# Altium project imu_sense.PrjPcb
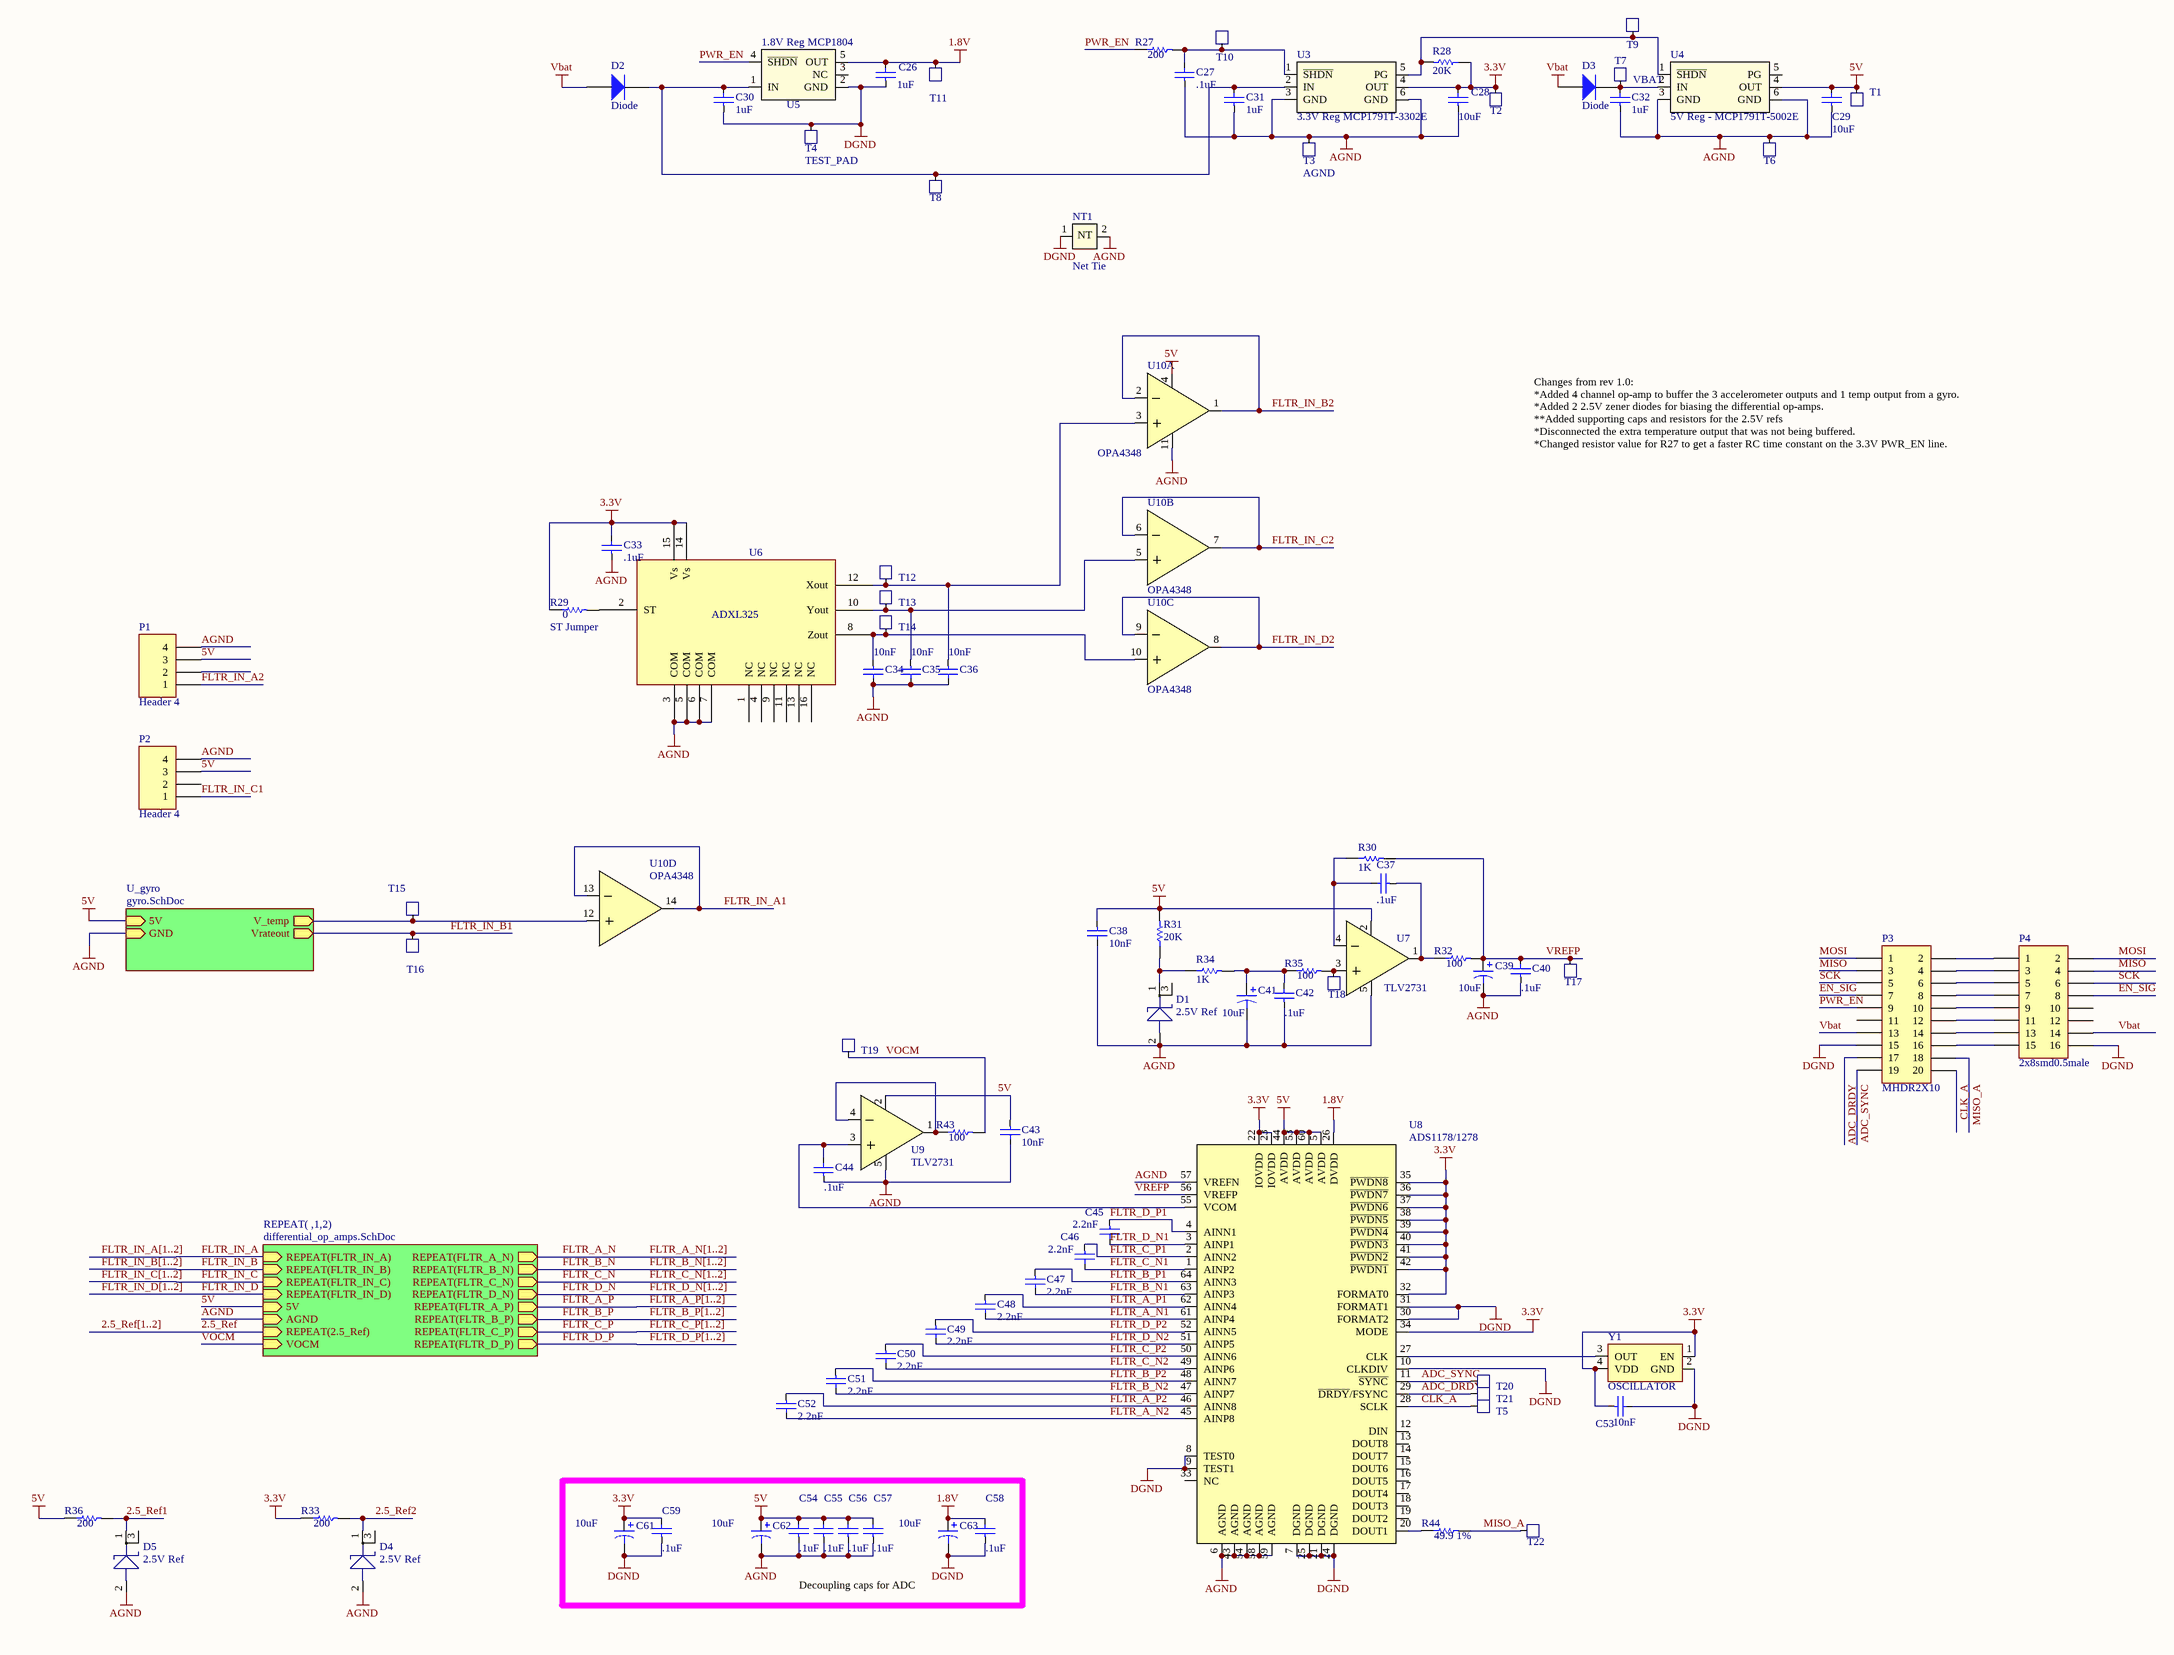
[diagram p0: imu_sense.SchDoc]
3 sheets, 188 parts. Net scope: hierarchical (ports join the sheet entries above them; power ports are global).
Board file: imu_sense.PcbDoc
Sheets:
  imu_sense.SchDoc
    1 = differential_op_amps.SchDoc
    2 = differential_op_amps.SchDoc
    U_gyro = gyro.SchDoc

## Sheet imu_sense.SchDoc
size C

### Parts
C26  1uF  [0603 (1608)]
C27  value .1uF  [0603 (1608)]  (hidden comment: Capacitor)
C28  10uF  [0603 (1608)]
C29  10uF  [0603 (1608)]
C30  1uF  [0603 (1608)]
C31  value 1uF  [0603 (1608)]  (hidden comment: Capacitor)
C32  value 1uF  [0603 (1608)]  (hidden comment: Capacitor)
C33  value .1uF  [0603 (1608)]  (hidden comment: Capacitor)
C34  10nF  [0603 (1608)]
C35  10nF  [0603 (1608)]
C36  10nF  [0603 (1608)]
C37  value .1uF  [0603 (1608)]  (hidden comment: Capacitor)
C38  10nF  [0603 (1608)]
C39  value 10uF  [CAP-POL 0603(1608)]  (hidden comment: tant)
C40  value .1uF  [0603 (1608)]  (hidden comment: Capacitor)
C41  value 10uF  [CAP-POL 0603(1608)]  (hidden comment: tant)
C42  value .1uF  [0603 (1608)]  (hidden comment: Capacitor)
C43  10nF  [0603 (1608)]
C44  value .1uF  [0603 (1608)]  (hidden comment: Capacitor)
C45  value 2.2nF  [0603 (1608)]  (hidden comment: Capacitor)
C46  value 2.2nF  [0603 (1608)]  (hidden comment: Capacitor)
C47  value 2.2nF  [0603 (1608)]  (hidden comment: Capacitor)
C48  value 2.2nF  [0603 (1608)]  (hidden comment: Capacitor)
C49  value 2.2nF  [0603 (1608)]  (hidden comment: Capacitor)
C50  value 2.2nF  [0603 (1608)]  (hidden comment: Capacitor)
C51  value 2.2nF  [0603 (1608)]  (hidden comment: Capacitor)
C52  value 2.2nF  [0603 (1608)]  (hidden comment: Capacitor)
C53  10nF  [0603 (1608)]
C54  value .1uF  [0603 (1608)]  (hidden comment: Capacitor)
C55  value .1uF  [0603 (1608)]  (hidden comment: Capacitor)
C56  value .1uF  [0603 (1608)]  (hidden comment: Capacitor)
C57  value .1uF  [0603 (1608)]  (hidden comment: Capacitor)
C58  value .1uF  [0603 (1608)]  (hidden comment: Capacitor)
C59  value .1uF  [0603 (1608)]  (hidden comment: Capacitor)
C61  value 10uF  [CAP-POL 0603(1608)]  (hidden comment: tant)
C62  value 10uF  [CAP-POL 0603(1608)]  (hidden comment: tant)
C63  value 10uF  [CAP-POL 0603(1608)]  (hidden comment: tant)
D1  2.5V Ref  [SC-70]
D2  Diode  [0603(1608) diode - line on pin2]
D3  Diode  [0603(1608) diode - line on pin2]
D4  2.5V Ref  [SC-70]
D5  2.5V Ref  [SC-70]
NT1  Net Tie  [NET_TIE]  (net tie, no BOM)
P1  Header 4  [gyro mount]
P2  Header 4  [gyro mount]
P3  MHDR2X10  [S9013E-10-ND]
P4  2x8smd0.5male  [Header, right hole]
R27  200  [0603 (1608)]
R28  20K  [0603 (1608)]
R29  ST Jumper  value 0  [0603 (1608)]
R30  1K  [0603 (1608)]
R31  20K  [0603 (1608)]
R32  100  [0603 (1608)]
R33  200  [0603 (1608)]
R34  1K  [0603 (1608)]
R35  100  [0603 (1608)]
R36  200  [0603 (1608)]
R43  100  [0603 (1608)]
R44  value 49.9 1%  [0603 (1608)]  (hidden comment: 931 1%)
T1  TEST_PAD  [TEST_PAD]  (value not drawn)
T2  TEST_PAD  [TEST_PAD]  (value not drawn)
T3  AGND  [TEST_PAD]
T4  TEST_PAD  [TEST_PAD]
T5  TEST_PAD  [TEST_PAD]  (value not drawn)
T6  TEST_PAD  [TEST_PAD]  (value not drawn)
T7  VBAT  [TEST_PAD]
T8  TEST_PAD  [TEST_PAD]  (value not drawn)
T9  TEST_PAD  [TEST_PAD]  (value not drawn)
T10  TEST_PAD  [TEST_PAD]  (value not drawn)
T11  TEST_PAD  [TEST_PAD]  (value not drawn)
T12  (no value)  [TEST_PAD]
T13  (no value)  [TEST_PAD]
T14  (no value)  [TEST_PAD]
T15  (no value)  [TEST_PAD]
T16  (no value)  [TEST_PAD]
T17  (no value)  [TEST_PAD]
T18  (no value)  [TEST_PAD]
T19  (no value)  [TEST_PAD]
T20  (no value)  [TEST_PAD]
T21  (no value)  [TEST_PAD]
T22  TEST_PAD  [TEST_PAD]  (value not drawn)
U3  3.3V Reg MCP1791T-3302E  [SOT223 - 5 leads + tab]
U4  5V Reg - MCP1791T-5002E  [SOT223 - 5 leads + tab]
U5  1.8V Reg MCP1804  [SOT23-5 - MCP1804T]
U6  ADXL325  [LFCSP_LQ_AXDL]
U7  TLV2731  [SOT23-5 Ti Op Amp]
U8  ADS1178/1278  [S-PQFP-G64]
U9  TLV2731  [SOT23-5 Ti Op Amp]
U10  OPA4348  [TSSOP-14]  (parts A,B,C,D of 4)
Y1  OSCILLATOR  [ABRACON Oscillator]

### Blocks framed on the sheet
Decoupling caps for ADC: C54-C59 C61-C63

### Sub-sheets
REPEAT( ,1,2) = differential_op_amps.SchDoc: REPEAT(FLTR_A_N) (out), REPEAT(FLTR_B_N) (out), REPEAT(FLTR_C_N) (out), REPEAT(FLTR_D_N) (out), REPEAT(FLTR_A_P) (out), REPEAT(FLTR_B_P) (out), REPEAT(FLTR_C_P) (out), REPEAT(FLTR_D_P) (out), REPEAT(FLTR_IN_A) (in), REPEAT(FLTR_IN_B) (in), REPEAT(FLTR_IN_C) (in), REPEAT(FLTR_IN_D) (in), 5V (in), AGND (in), VOCM (in), REPEAT(2.5_Ref) (in)
U_gyro = gyro.SchDoc: V_temp (out), Vrateout (out), 5V (in), GND (in)

### Nets
1.8V: C26.1 C58.1 C63.1 T11.0 U5.5(OUT) U8.26(DVDD)
3.3V: C28.1 C33.1 C53.2 C59.1 C61.1 R28.1 R29.1 R33.1 T2.0 U3.4(OUT) U6.14(Vs) U6.15(Vs) U8.22(IOVDD) U8.23(IOVDD) U8.32(FORMAT0) U8.34(MODE) U8.35(~{PWDN8}) U8.36(~{PWDN7}) U8.37(~{PWDN6}) U8.38(~{PWDN5}) U8.39(~{PWDN4}) U8.40(~{PWDN3}) U8.41(~{PWDN2}) U8.42(~{PWDN1}) Y1.1(EN) Y1.4(VDD)
5V: C29.1 C38.2 C43.2 C54.1 C55.1 C56.1 C57.1 C62.1 P1.3 P2.3 R31.2 R36.1 T1.0 U4.4(OUT) U7.2(V+) U8.5(AVDD) U8.44(AVDD) U8.53(AVDD) U8.60(AVDD) U9.2(V+) U10.4(V+) ; sheet REPEAT( ,1,2)/5V, sheet U_gyro/5V
AGND: C27.2 C28.2 C29.2 C31.2 C32.2 C33.2 C34.1 C35.1 C36.1 C38.1 C39.2 C40.2 C41.2 C42.2 C43.1 C44.2 C54.2 C55.2 C56.2 C57.2 C62.2 D1.2(Anode) D4.2(Anode) D5.2(Anode) NT1.2 P1.4 P2.4 T3.0 T6.0 U3.3(GND) U3.6(GND) U4.3(GND) U4.6(GND) U6.3(COM) U6.5(COM) U6.6(COM) U6.7(COM) U7.5(V-) U8.6(AGND) U8.43(AGND) U8.54(AGND) U8.57(VREFN) U8.58(AGND) U8.59(AGND) U9.5(V-) U10.11(V-) ; sheet REPEAT( ,1,2)/AGND, sheet U_gyro/GND
DGND: C26.2 C30.2 C53.1 C58.2 C59.2 C61.2 C63.2 NT1.1 P3.15 P4.16 T4.0 U5.2(GND) U8.7(DGND) U8.8(TEST0) U8.9(TEST1) U8.10(CLKDIV) U8.21(DGND) U8.24(DGND) U8.25(DGND) U8.30(FORMAT2) U8.31(FORMAT1) Y1.2(GND)
Vbat: D2.1(A) D3.1(A) P3.13 P4.14
2.5_Ref: sheet REPEAT( ,1,2)/REPEAT(2.5_Ref)
2.5_Ref1: D5.1(Cathode) R36.2
2.5_Ref2: D4.1(Cathode) R33.2
ADC_DRDY: P3.17 T21.0 U8.29(~{DRDY}/FSYNC)
ADC_SYNC: P3.19 T20.0 U8.11(~{SYNC})
CLK_A: P3.20 T5.0 U8.28(SCLK)
EN_SIG: P3.7 P4.8
FLTR_A_N: sheet REPEAT( ,1,2)/REPEAT(FLTR_A_N)
FLTR_A_N1: C48.1 U8.61(AINP4)  [project net FLTR_A_N]
FLTR_A_N2: C52.1 U8.45(AINP8)  [project net FLTR_A_N]
FLTR_A_P: sheet REPEAT( ,1,2)/REPEAT(FLTR_A_P)
FLTR_A_P1: C48.2 U8.62(AINN4)  [project net FLTR_A_P]
FLTR_A_P2: C52.2 U8.46(AINN8)  [project net FLTR_A_P]
FLTR_B_N: sheet REPEAT( ,1,2)/REPEAT(FLTR_B_N)
FLTR_B_N1: C47.1 U8.63(AINP3)  [project net FLTR_B_N]
FLTR_B_N2: C51.1 U8.47(AINP7)  [project net FLTR_B_N]
FLTR_B_P: sheet REPEAT( ,1,2)/REPEAT(FLTR_B_P)
FLTR_B_P1: C47.2 U8.64(AINN3)  [project net FLTR_B_P]
FLTR_B_P2: C51.2 U8.48(AINN7)  [project net FLTR_B_P]
FLTR_C_N: sheet REPEAT( ,1,2)/REPEAT(FLTR_C_N)
FLTR_C_N1: C46.1 U8.1(AINP2)  [project net FLTR_C_N]
FLTR_C_N2: C50.1 U8.49(AINP6)  [project net FLTR_C_N]
FLTR_C_P: sheet REPEAT( ,1,2)/REPEAT(FLTR_C_P)
FLTR_C_P1: C46.2 U8.2(AINN2)  [project net FLTR_C_P]
FLTR_C_P2: C50.2 U8.50(AINN6)  [project net FLTR_C_P]
FLTR_D_N: sheet REPEAT( ,1,2)/REPEAT(FLTR_D_N)
FLTR_D_N1: C45.1 U8.3(AINP1)  [project net FLTR_D_N]
FLTR_D_N2: C49.1 U8.51(AINP5)  [project net FLTR_D_N]
FLTR_D_P: sheet REPEAT( ,1,2)/REPEAT(FLTR_D_P)
FLTR_D_P1: C45.2 U8.4(AINN1)  [project net FLTR_D_P]
FLTR_D_P2: C49.2 U8.52(AINN5)  [project net FLTR_D_P]
FLTR_IN_A: sheet REPEAT( ,1,2)/REPEAT(FLTR_IN_A)
FLTR_IN_A1: U10.13(-IN) U10.14(Out)  [project net FLTR_IN_A]
FLTR_IN_A2: P1.1  [project net FLTR_IN_A]
FLTR_IN_B: sheet REPEAT( ,1,2)/REPEAT(FLTR_IN_B)
FLTR_IN_B1: T16.0 ; sheet U_gyro/Vrateout  [project net FLTR_IN_B]
FLTR_IN_B2: U10.1(Out) U10.2(-IN)  [project net FLTR_IN_B]
FLTR_IN_C: sheet REPEAT( ,1,2)/REPEAT(FLTR_IN_C)
FLTR_IN_C1: P2.1  [project net FLTR_IN_C]
FLTR_IN_C2: U10.6(-IN) U10.7(Out)  [project net FLTR_IN_C]
FLTR_IN_D: sheet REPEAT( ,1,2)/REPEAT(FLTR_IN_D)
FLTR_IN_D2: U10.8(Out) U10.9(-IN)  [project net FLTR_IN_D]
MISO: P3.3 P4.4
MISO_A: P3.18 R44.2 T22.0
MOSI: P3.1 P4.2
PWR_EN: P3.9 R27.1 U5.4(~{SHDN})
SCK: P3.5 P4.6
V_temp: T15.0 U10.12(+IN) ; sheet U_gyro/V_temp
VOCM: R43.2 T19.0 ; sheet REPEAT( ,1,2)/VOCM
VREFP: C39.1 C40.1 R30.2 R32.2 T17.0 U8.56(VREFP)
NetC27_1: C27.1 R27.2 T10.0 U3.1(~{SHDN})
NetC30_1: C30.1 C31.1 D2.2(K) T8.0 U3.2(IN) U5.1(IN)
NetC32_1: C32.1 D3.2(K) T7.0 U4.2(IN)
NetC34_2: C34.2 T14.0 U6.8(Zout) U10.10(+IN)
NetC35_2: C35.2 T13.0 U6.10(Yout) U10.5(+IN)
NetC36_2: C36.2 T12.0 U6.12(Xout) U10.3(+IN)
NetC37_1: C37.1 R30.1 U7.4(-IN)
NetC37_2: C37.2 R32.1 U7.1(Out)
NetC41_1: C41.1 C42.1 R34.2 R35.1
NetC44_1: C44.1 U8.55(VCOM) U9.3(+IN)
NetD1_1: D1.1(Cathode) R31.1 R34.1
NetP3_2: P3.2 P4.1
NetP3_4: P3.4 P4.3
NetP3_6: P3.6 P4.5
NetP3_8: P3.8 P4.7
NetP3_10: P3.10 P4.9
NetP3_12: P3.12 P4.11
NetP3_14: P3.14 P4.13
NetP3_16: P3.16 P4.15
NetR28_2: R28.2 T9.0 U3.5(PG) U4.1(~{SHDN})
NetR29_2: R29.2 U6.2(ST)
NetR35_2: R35.2 T18.0 U7.3(+IN)
NetR43_1: R43.1 U9.1(Out) U9.4(-IN)
NetR44_1: R44.1 U8.20(DOUT1)
NetU8_27: U8.27(CLK) Y1.3(OUT)

Not connected (* = marked no-connect by the designer): D1 3(Trim); D4 3(Trim); D5 3(Trim); P1 2; P2 2; P3 11; P4 10 12; U4 5(PG); U5 3(NC); U6 1(NC) 4(NC) 9(NC) 11(NC) 13(NC) 16(NC); U8 12(DIN) 13(DOUT8) 14(DOUT7) 15(DOUT6) 16(DOUT5) 17(DOUT4) 18(DOUT3) 19(DOUT2) 33(NC)

### Buses and harness runs
bus 2.5_Ref[1..2]
bus FLTR_A_N[1..2]
bus FLTR_A_P[1..2]
bus FLTR_B_N[1..2]
bus FLTR_B_P[1..2]
bus FLTR_C_N[1..2]
bus FLTR_C_P[1..2]
bus FLTR_D_N[1..2]
bus FLTR_D_P[1..2]
bus FLTR_IN_A[1..2]
bus FLTR_IN_B[1..2]
bus FLTR_IN_C[1..2]
bus FLTR_IN_D[1..2]

### Notes on the sheet
- Changes from rev 1.0:
  *Added 4 channel op-amp to buffer the 3 accelerometer outputs and 1 temp output from a gyro.
  *Added 2 2.5V zener diodes for biasing the differential op-amps.
  **Added supporting caps and resistors for the 2.5V refs
  *Disconnected the extra temperature output that was not being buffered.
  *Changed resistor value for R27 to get a faster RC time constant on the 3.3V PWR_EN line.
- (in symbol NET_TIE) NT

### Library data of the parts
C26 C30-C32 = Capacitor: Manufacturer: Murata; Part No.: 81-GRM188R61E105KA12; Vendor: Mouser; Tolerance: 10%; Voltage: 25V; Price Est.: $0.08
  C26 C30: Value: 1uF
C27 C33 C37 C40 C42 C44 C54-C59 = Capacitor: Manufacturer: Murata; Part No.: 490-1524-1-ND; Vendor: Digikey; Price Est.: $0.019
C28 C29 = Capacitor: Manufacturer: Murata; Part No.: 810-C1608X5R0J106K; Vendor: Mouser; Tolerance: 10%; Voltage: 6.3V; Price Est.: $0.56; Value: 10uF
C34-C36 C38 C43 C53 = Capacitor: Manufacturer: TDK; Part No.: 445-5099-1-ND; Vendor: Digikey; Tolerance: 5%; Price Est.: $0.044; Value: 10nF
C39 C41 C61-C63 = Cap Pol3: Polarized Capacitor (Surface Mount); Part No.: 71-298D106X06R3M2T; Special: Tantalum; Estimated Cost: $1.21; Vendor: Mouser
C45-C52 = Capacitor: COG Ceramic Cap -> near input to ads1178; Manufacturer: Murata; Part No.: 490-1459-1-ND; Vendor: Digikey; Special: COG, NPO; Price Est.: $0.078
D1 D4 D5 = ZENER: 2.5 volt ref; Part No.: ADR525BKSZ-REEL7CT-ND; Manufacturer: Analog Devices; Vendor: Digikey; Price Est.: $2.20
D2 D3 = Diode: Reverse voltage protection diode; Part No.: 641-1332-1-ND; Vendor: Digikey; Reverse Voltage: 20V; Forward Current: 500mA; Price Est.: $0.46
NT1 = NET_TIE
P1 P2 = Header 4: Header, 4-Pin; Part No.: A31114-ND; Vendor: Digikey; Price Est.: $0.20
P3 = MHDR2X10: Header, 10-Pin, Female; Part No.: S9007E-10-ND; Vendor: Digikey; Price Est.: $2.28
P4 = 2x8smd0.5male: Part No.: S9013E-08-ND; Vendor: Digikey; Price Est.: 1.43
R27 R33 R36 = Res1: Resistor; Part No.: P200GCT-ND; Vendor: Digikey; Value: 200; Price Est.: $0.03
R28 R31 = Res1: Resistor; Part No.: P20KGCT-ND; Vendor: Digikey; Value: 20K; Price Est.: $0.03
R29 = Res1: Resistor; Part No.: P0.0GCT-ND; Price Est.: $0.03
R30 R34 = Res1: Resistor; Part No.: P1.0KGCT-ND; Vendor: Digikey; Estimated Cost: $0.03; Tolerance: 5%; Value: 1K
R32 R35 R43 = Res1: Resistor; Part No.: P100GCT-ND; Vendor: Digikey; Value: 100; Price Est.: $0.03
R44 = Res1: Resistor; Part No.: P49.9HCT-ND; Vendor: Digikey; Price Est.: $0.04
T3 T7 T12-T21 = TEST_PAD
U3 = 5V Reg - MCP1791T-5002E/DC: 3.3V, 70mA LDO with SHDN and PWRGD pins; Part No.: MCP1791T-3302E/DCCT-ND; Vendor: Digikey; Price Est.: $0.90
U4 = 5V Reg - MCP1791T-5002E/DC: 5V, 70mA LDO with SHDN and PWRGD pins; Part No.: MCP1791T-5002E/DCCT-ND; Vendor: Digikey; Price Est.: $0.90
U5 = 1.8V Reg: 1.8V Reg. MCP1804; Part No.: MCP1804T-1802I/OTCT-ND; Vendor: Digikey; Price Est.: $0.81
U6 = ADXL325: Part No.: ADXL325BCPZ-RL7CT-ND; Vendor: Digikey; Price Est.: $4.82
U7 U9 = TI Small Op Amp: Part No.: 296-10656-1-ND; Manufacturer: Texas Instruments; Vendor: Digikey; Price Est.: $1.41
U8 = ADS1178: The ADS1178 and 1278 are pin compatible. 16 and 24 bits, respectively.; Manufacturer: Texas Instruments; Vendor: Digikey; Price Est.: $21.00
Y1 = OSCILLATOR: Part No.: 535-9778-1-ND; Manufacturer: Abracon; Frequency: 1.8432 MHz; Vendor: Digikey; Price Est.: $2.93

## Sheet differential_op_amps.SchDoc
size A
Used 2 times, as channels 1, 2. Parts and nets are listed once, with the designators drawn on the sheet.
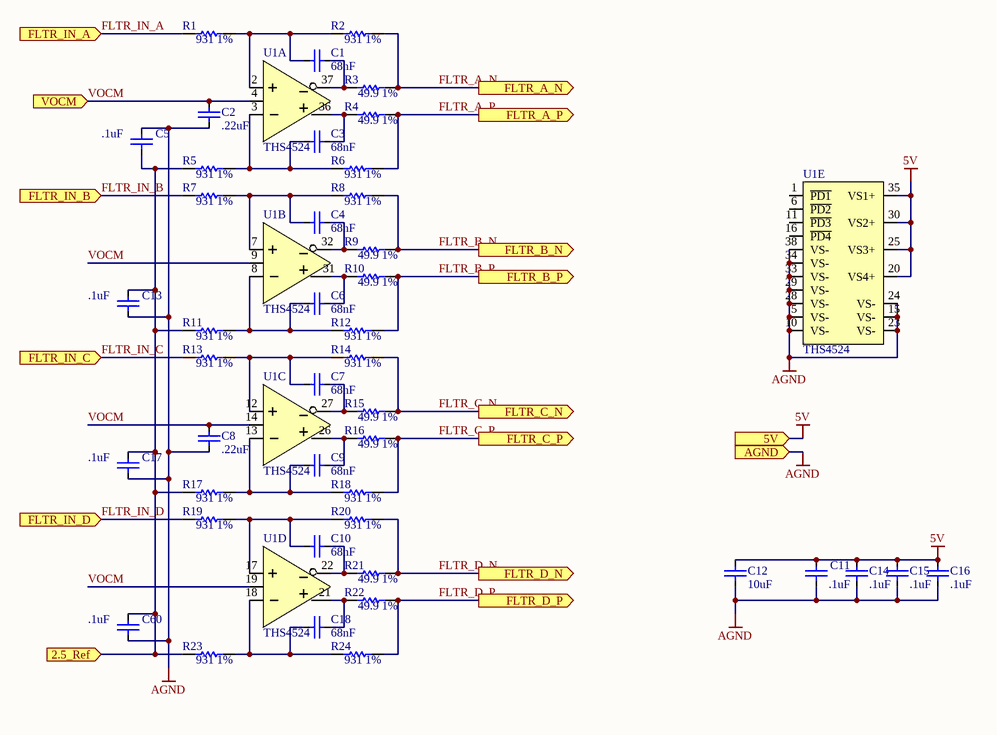
[diagram p1: differential_op_amps.SchDoc]

### Parts
C1  value 68nF  [0603 (1608)]  (hidden comment: Capacitor)
C2  value .22uF  [0603 (1608)]  (hidden comment: Capacitor)
C3  value 68nF  [0603 (1608)]  (hidden comment: Capacitor)
C4  value 68nF  [0603 (1608)]  (hidden comment: Capacitor)
C5  value .1uF  [0603 (1608)]  (hidden comment: Capacitor)
C6  value 68nF  [0603 (1608)]  (hidden comment: Capacitor)
C7  value 68nF  [0603 (1608)]  (hidden comment: Capacitor)
C8  value .22uF  [0603 (1608)]  (hidden comment: Capacitor)
C9  value 68nF  [0603 (1608)]  (hidden comment: Capacitor)
C10  value 68nF  [0603 (1608)]  (hidden comment: Capacitor)
C11  value .1uF  [0603 (1608)]  (hidden comment: Capacitor)
C12  value 10uF  [0603 (1608)]  (hidden comment: Capacitor)
C13  value .1uF  [0603 (1608)]  (hidden comment: Capacitor)
C14  value .1uF  [0603 (1608)]  (hidden comment: Capacitor)
C15  value .1uF  [0603 (1608)]  (hidden comment: Capacitor)
C16  value .1uF  [0603 (1608)]  (hidden comment: Capacitor)
C17  value .1uF  [0603 (1608)]  (hidden comment: Capacitor)
C18  value 68nF  [0603 (1608)]  (hidden comment: Capacitor)
C60  value .1uF  [0603 (1608)]  (hidden comment: Capacitor)
R1  931 1%  [0603 (1608)]
R2  931 1%  [0603 (1608)]
R3  value 49.9 1%  [0603 (1608)]  (hidden comment: 931 1%)
R4  value 49.9 1%  [0603 (1608)]  (hidden comment: 931 1%)
R5  931 1%  [0603 (1608)]
R6  931 1%  [0603 (1608)]
R7  931 1%  [0603 (1608)]
R8  931 1%  [0603 (1608)]
R9  value 49.9 1%  [0603 (1608)]  (hidden comment: 931 1%)
R10  value 49.9 1%  [0603 (1608)]  (hidden comment: 931 1%)
R11  931 1%  [0603 (1608)]
R12  931 1%  [0603 (1608)]
R13  931 1%  [0603 (1608)]
R14  931 1%  [0603 (1608)]
R15  value 49.9 1%  [0603 (1608)]  (hidden comment: 931 1%)
R16  value 49.9 1%  [0603 (1608)]  (hidden comment: 931 1%)
R17  931 1%  [0603 (1608)]
R18  931 1%  [0603 (1608)]
R19  931 1%  [0603 (1608)]
R20  931 1%  [0603 (1608)]
R21  value 49.9 1%  [0603 (1608)]  (hidden comment: 931 1%)
R22  value 49.9 1%  [0603 (1608)]  (hidden comment: 931 1%)
R23  931 1%  [0603 (1608)]
R24  931 1%  [0603 (1608)]
U1  THS4524  [TSSOP-38]  (parts A,B,C,D,E of 5)

### Ports
2.5_Ref (in), 5V (in), AGND (in), FLTR_A_N (out), FLTR_A_P (out), FLTR_B_N (out), FLTR_B_P (out), FLTR_C_N (out), FLTR_C_P (out), FLTR_D_N (out), FLTR_D_P (out), FLTR_IN_A (in), FLTR_IN_B (in), FLTR_IN_C (in), FLTR_IN_D (in), VOCM (in)

### Nets
5V: C11.1 C12.1 C14.1 C15.1 C16.1 U1.20(VS4+) U1.25(VS3+) U1.30(VS2+) U1.35(VS1+) ; port 5V
AGND: C2.1 C5.1 C8.1 C11.2 C12.2 C13.2 C14.2 C15.2 C16.2 C17.2 C60.2 U1.5(VS-) U1.10(VS-) U1.15(VS-) U1.23(VS-) U1.24(VS-) U1.28(VS-) U1.29(VS-) U1.33(VS-) U1.34(VS-) U1.38(VS-) ; port AGND
2.5_Ref: C5.2 C13.1 C17.1 C60.1 R5.1 R11.1 R17.1 R23.1 ; port 2.5_Ref
FLTR_A_N: R2.2 R3.2 ; port FLTR_A_N
FLTR_A_P: R4.2 R6.2 ; port FLTR_A_P
FLTR_B_N: R8.2 R9.2 ; port FLTR_B_N
FLTR_B_P: R10.2 R12.2 ; port FLTR_B_P
FLTR_C_N: R14.2 R15.2 ; port FLTR_C_N
FLTR_C_P: R16.2 R18.2 ; port FLTR_C_P
FLTR_D_N: R20.2 R21.2 ; port FLTR_D_N
FLTR_D_P: R22.2 R24.2 ; port FLTR_D_P
FLTR_IN_A: R1.1 ; port FLTR_IN_A
FLTR_IN_B: R7.1 ; port FLTR_IN_B
FLTR_IN_C: R13.1 ; port FLTR_IN_C
FLTR_IN_D: R19.1 ; port FLTR_IN_D
VOCM: C2.2 C8.2 U1.4(VOCM1) U1.9(VOCM2) U1.14(VOCM3) U1.19(VOCM4) ; port VOCM
NetC1_1: C1.1 R3.1 U1.37(VOUT1-)
NetC1_2: C1.2 R1.2 R2.1 U1.2(VIN1+)
NetC3_1: C3.1 R4.1 U1.36(VOUT1+)
NetC3_2: C3.2 R5.2 R6.1 U1.3(VIN1-)
NetC4_1: C4.1 R9.1 U1.32(VOUT2-)
NetC4_2: C4.2 R7.2 R8.1 U1.7(VIN2+)
NetC6_1: C6.1 R10.1 U1.31(VOUT2+)
NetC6_2: C6.2 R11.2 R12.1 U1.8(VIN2-)
NetC7_1: C7.1 R15.1 U1.27(VOUT3-)
NetC7_2: C7.2 R13.2 R14.1 U1.12(VIN3+)
NetC9_1: C9.1 R16.1 U1.26(VOUT3+)
NetC9_2: C9.2 R17.2 R18.1 U1.13(VIN3-)
NetC10_1: C10.1 R21.1 U1.22(VOUT4_)
NetC10_2: C10.2 R19.2 R20.1 U1.17(VIN4+)
NetC18_1: C18.1 R22.1 U1.21(VOUT4+)
NetC18_2: C18.2 R23.2 R24.1 U1.18(VIN4-)

Not connected (* = marked no-connect by the designer): U1 1(~{PD1}) 6(~{PD2}) 11(~{PD3}) 16(~{PD4})

### Channels
1: designators end in _1; ports 2.5_Ref=2.5_Ref1 5V=5V AGND=AGND FLTR_A_N=FLTR_A_N FLTR_A_P=FLTR_A_P FLTR_B_N=FLTR_B_N FLTR_B_P=FLTR_B_P FLTR_C_N=FLTR_C_N FLTR_C_P=FLTR_C_P FLTR_D_N=FLTR_D_N FLTR_D_P=FLTR_D_P FLTR_IN_A=FLTR_IN_A FLTR_IN_B=FLTR_IN_B FLTR_IN_C=FLTR_IN_C FLTR_IN_D=FLTR_IN_D_1 VOCM=VOCM
2: designators end in _2; ports 2.5_Ref=2.5_Ref2 5V=5V AGND=AGND FLTR_A_N=FLTR_A_N FLTR_A_P=FLTR_A_P FLTR_B_N=FLTR_B_N FLTR_B_P=FLTR_B_P FLTR_C_N=FLTR_C_N FLTR_C_P=FLTR_C_P FLTR_D_N=FLTR_D_N FLTR_D_P=FLTR_D_P FLTR_IN_A=FLTR_IN_A FLTR_IN_B=FLTR_IN_B FLTR_IN_C=FLTR_IN_C FLTR_IN_D=FLTR_IN_D VOCM=VOCM

### Library data of the parts
C1 C3 C4 C6 C7 C9 C10 C18 = Capacitor: Manufacturer: TDK; Part No.: 445-5096-1-ND; Vendor: Digikey; Price Est.: $0.061
C2 C8 = Capacitor: Manufacturer: TDK; Part No.: 445-1318-1-ND; Vendor: Digikey; Price Est.: $0.061
C5 C11 C13-C17 C60 = Capacitor: as C27 on sheet imu_sense; Price Est.: $0.019
C12 = Capacitor: Manufacturer: Taiyo Yuden; Part No.: 587-2562-1-ND; Vendor: Digikey; Tolerance: 20%; Price Est.: $0.64
R1 R2 R5-R8 R11-R14 R17-R20 R23 R24 = Res1: Resistor; Part No.: P931HCT-ND; Vendor: Digikey; Value: 931 1%; Price Est.: $0.04
R3 R4 R9 R10 R15 R16 R21 R22 = Res1: as R44 on sheet imu_sense; Price Est.: $0.04
U1 = THS4524: Part No.: 296-24315-1-ND; Price Est.: $8.35

## Sheet gyro.SchDoc
size A
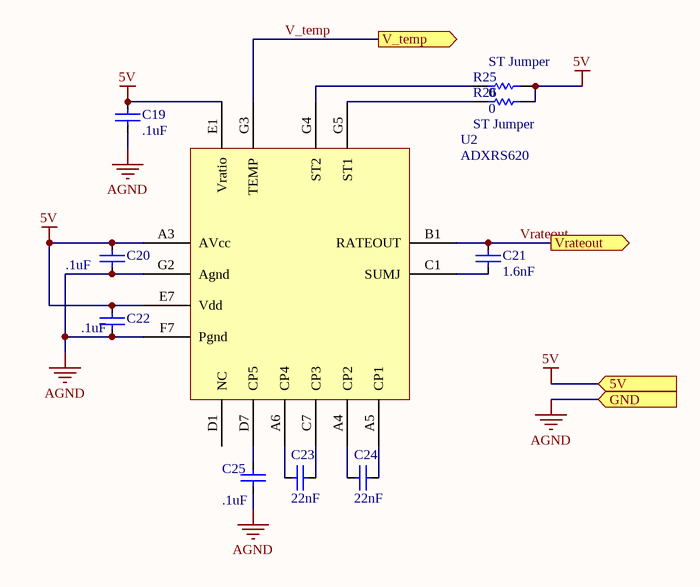
[diagram p2: gyro.SchDoc]

### Parts
C19  value .1uF  [0603 (1608)]  (hidden comment: Capacitor)
C20  value .1uF  [0603 (1608)]  (hidden comment: Capacitor)
C21  value 1.6nF  [0603 (1608)]  (hidden comment: Capacitor)
C22  value .1uF  [0603 (1608)]  (hidden comment: Capacitor)
C23  value 22nF  [0603 (1608)]  (hidden comment: Capacitor)
C24  value 22nF  [0603 (1608)]  (hidden comment: Capacitor)
C25  value .1uF  [0603 (1608)]  (hidden comment: Capacitor)
R25  ST Jumper  value 0  [0603 (1608)]
R26  ST Jumper  value 0  [0603 (1608)]
U2  ADXRS620  [BGA_AXDR]

### Ports
5V (in), GND (in), V_temp (out), Vrateout (out)

### Nets
5V: C19.1 C20.1 C22.1 R25.2 R26.2 U2.A3(AVcc) U2.E1(Vratio) U2.E7(Vdd) ; port 5V
AGND: C19.2 C20.2 C22.2 C25.2 U2.F7(Pgnd) U2.G2(Agnd) ; port GND
V_temp: U2.G3(TEMP) ; port V_temp
Vrateout: C21.2 U2.B1(RATEOUT) ; port Vrateout  [project net FLTR_IN_B]
NetC21_1: C21.1 U2.C1(SUMJ)
NetC23_1: C23.1 U2.A6(CP4)
NetC23_2: C23.2 U2.C7(CP3)
NetC24_1: C24.1 U2.A4(CP2)
NetC24_2: C24.2 U2.A5(CP1)
NetC25_1: C25.1 U2.D7(CP5)
NetR25_1: R25.1 U2.G4(ST2)
NetR26_1: R26.1 U2.G5(ST1)

Not connected (* = marked no-connect by the designer): U2 D1(NC)

### Library data of the parts
C19 C20 C22 C25 = Capacitor: as C27 on sheet imu_sense; Price Est.: $0.019
C21 = Capacitor: Manufacturer: Murata; Part No.: 490-1456-1-ND; Vendor: Digikey; Price Est.: $0.084
C23 C24 = Capacitor: Manufacturer: TDK; Part No.: 445-5104-1-ND; Vendor: Digikey; Price Est.: $0.03
R25 R26 = Res1: Resistor

## Nets that join several sheets
5V: imu_sense (21 pins), 1 (9 pins), 2 (9 pins), gyro (8 pins)
AGND: imu_sense (46 pins), 1 (21 pins), 2 (21 pins), gyro (6 pins)
2.5_Ref1: imu_sense (D5.1 R36.2), 1 (8 pins)
2.5_Ref2: imu_sense (D4.1 R33.2), 2 (8 pins)
FLTR_A_N: imu_sense (C48.1 U8.61), 1 (R2_1.2 R3_1.2)
FLTR_A_N: imu_sense (C52.1 U8.45), 2 (R2_2.2 R3_2.2)
FLTR_A_P: imu_sense (C48.2 U8.62), 1 (R4_1.2 R6_1.2)
FLTR_A_P: imu_sense (C52.2 U8.46), 2 (R4_2.2 R6_2.2)
FLTR_B_N: imu_sense (C47.1 U8.63), 1 (R8_1.2 R9_1.2)
FLTR_B_N: imu_sense (C51.1 U8.47), 2 (R8_2.2 R9_2.2)
FLTR_B_P: imu_sense (C47.2 U8.64), 1 (R10_1.2 R12_1.2)
FLTR_B_P: imu_sense (C51.2 U8.48), 2 (R10_2.2 R12_2.2)
FLTR_C_N: imu_sense (C46.1 U8.1), 1 (R14_1.2 R15_1.2)
FLTR_C_N: imu_sense (C50.1 U8.49), 2 (R14_2.2 R15_2.2)
FLTR_C_P: imu_sense (C46.2 U8.2), 1 (R16_1.2 R18_1.2)
FLTR_C_P: imu_sense (C50.2 U8.50), 2 (R16_2.2 R18_2.2)
FLTR_D_N: imu_sense (C45.1 U8.3), 1 (R20_1.2 R21_1.2)
FLTR_D_N: imu_sense (C49.1 U8.51), 2 (R20_2.2 R21_2.2)
FLTR_D_P: imu_sense (C45.2 U8.4), 1 (R22_1.2 R24_1.2)
FLTR_D_P: imu_sense (C49.2 U8.52), 2 (R22_2.2 R24_2.2)
FLTR_IN_A: imu_sense (P1.1), 2 (R1_2.1)
FLTR_IN_A: imu_sense (U10.13 U10.14), 1 (R1_1.1)
FLTR_IN_B: imu_sense (T16.0), 1 (R7_1.1), gyro (C21.2 U2.B1)
FLTR_IN_B: imu_sense (U10.1 U10.2), 2 (R7_2.1)
FLTR_IN_C: imu_sense (P2.1), 1 (R13_1.1)
FLTR_IN_C: imu_sense (U10.6 U10.7), 2 (R13_2.1)
FLTR_IN_D: imu_sense (U10.8 U10.9), 2 (R19_2.1)
V_temp: imu_sense (T15.0 U10.12), gyro (U2.G3)
VOCM: imu_sense (R43.2 T19.0), 1 (6 pins), 2 (6 pins)